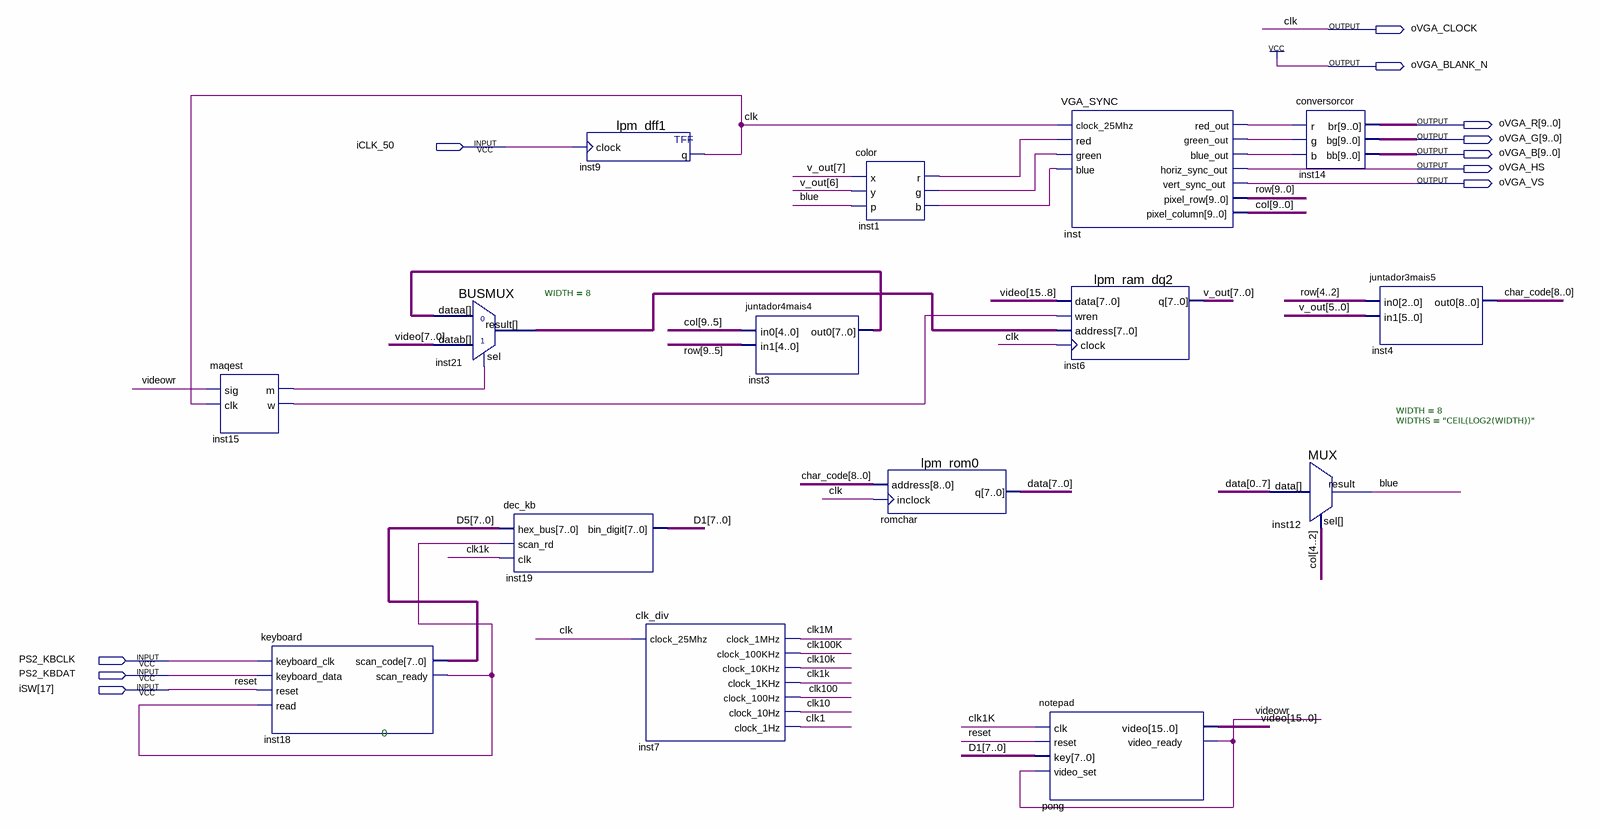
[diagram p0: schematic sheet]
// Quartus schematic ap7.bdf as structural Verilog: 15 symbols, 11 pins
module ap7 (
  input  iCLK_50,
  input  PS2_KBCLK,
  input  PS2_KBDAT,
  input  [17:17] iSW,
  output oVGA_CLOCK,
  output oVGA_BLANK_N,
  output [9:0] oVGA_R,
  output [9:0] oVGA_G,
  output [9:0] oVGA_B,
  output oVGA_HS,
  output oVGA_VS
);

  wire blue, clk1, clk1k, clk1M, clk10, clk10k, clk100, clk100K, inst1_b, inst1_g, inst1_r, inst15_m,
       inst15_w, inst18_scan_ready, inst_blue_out, inst_green_out, inst_red_out, videowr;
  wire [7:0] D1, D5, data, inst3_out0, inst21_result, v_out;
  wire [8:0] char_code;
  wire [9:0] col, row;
  wire [15:0] video;

  maqest inst15 (.sig(videowr), .clk(oVGA_CLOCK), .m(inst15_m), .w(inst15_w));
  keyboard inst18 (
    .keyboard_clk(PS2_KBCLK), .keyboard_data(PS2_KBDAT), .reset(iSW[17]), .read(inst18_scan_ready),
    .scan_code(D5), .scan_ready(inst18_scan_ready));
  BUSMUX #(.WIDTH(8)) inst21 (.datab(video[7:0]), .sel(inst15_m), .dataa(inst3_out0), .result(inst21_result));
  dec_kb inst19 (.hex_bus(D5), .scan_rd(inst18_scan_ready), .clk(clk1k), .bin_digit(D1));
  lpm_dff1 inst9 (.clock(iCLK_50), .q(oVGA_CLOCK));
  clk_div inst7 (
    .clock_25Mhz(oVGA_CLOCK), .clock_1MHz(clk1M), .clock_100KHz(clk100K), .clock_10KHz(clk10k),
    .clock_1KHz(clk1k), .clock_100Hz(clk100), .clock_10Hz(clk10), .clock_1Hz(clk1));
  juntador4mais4 inst3 (.in0(col[9:5]), .in1(row[9:5]), .out0(inst3_out0));
  color inst1 (.x(v_out[7]), .y(v_out[6]), .p(blue), .r(inst1_r), .g(inst1_g), .b(inst1_b));
  lpm_rom0 romchar (.address(char_code), .inclock(oVGA_CLOCK), .q(data));
  notepad pong (.clk(clk1k), .reset(iSW[17]), .key(D1), .video_set(videowr), .video(video), .video_ready(videowr));
  VGA_SYNC inst (
    .clock_25Mhz(oVGA_CLOCK), .red(inst1_r), .green(inst1_g), .blue(inst1_b), .red_out(inst_red_out),
    .green_out(inst_green_out), .blue_out(inst_blue_out), .horiz_sync_out(oVGA_HS), .vert_sync_out(oVGA_VS),
    .pixel_row(row), .pixel_column(col));
  lpm_ram_dq2 inst6 (.data(video[15:8]), .wren(inst15_w), .address(inst21_result), .clock(oVGA_CLOCK), .q(v_out));
  MUX #(.WIDTH(8), .WIDTHS("CEIL(LOG2(WIDTH))")) inst12 (
    .data({data[0], data[1], data[2], data[3], data[4], data[5], data[6], data[7]}), .sel(col[4:2]),
    .result(blue));
  conversorcor inst14 (.r(inst_red_out), .g(inst_green_out), .b(inst_blue_out), .br(oVGA_R), .bg(oVGA_G), .bb(oVGA_B));
  juntador3mais5 inst4 (.in0(row[4:2]), .in1(v_out[5:0]), .out0(char_code));

  assign oVGA_BLANK_N = 1'b1;

  // Other names for the same wires on the sheet: clk = oVGA_CLOCK; reset = iSW[17]

  // Notes on the sheet:
  //   0
endmodule
